# EAGLE schematic bare_bone_arduino (EAGLE 6.4)
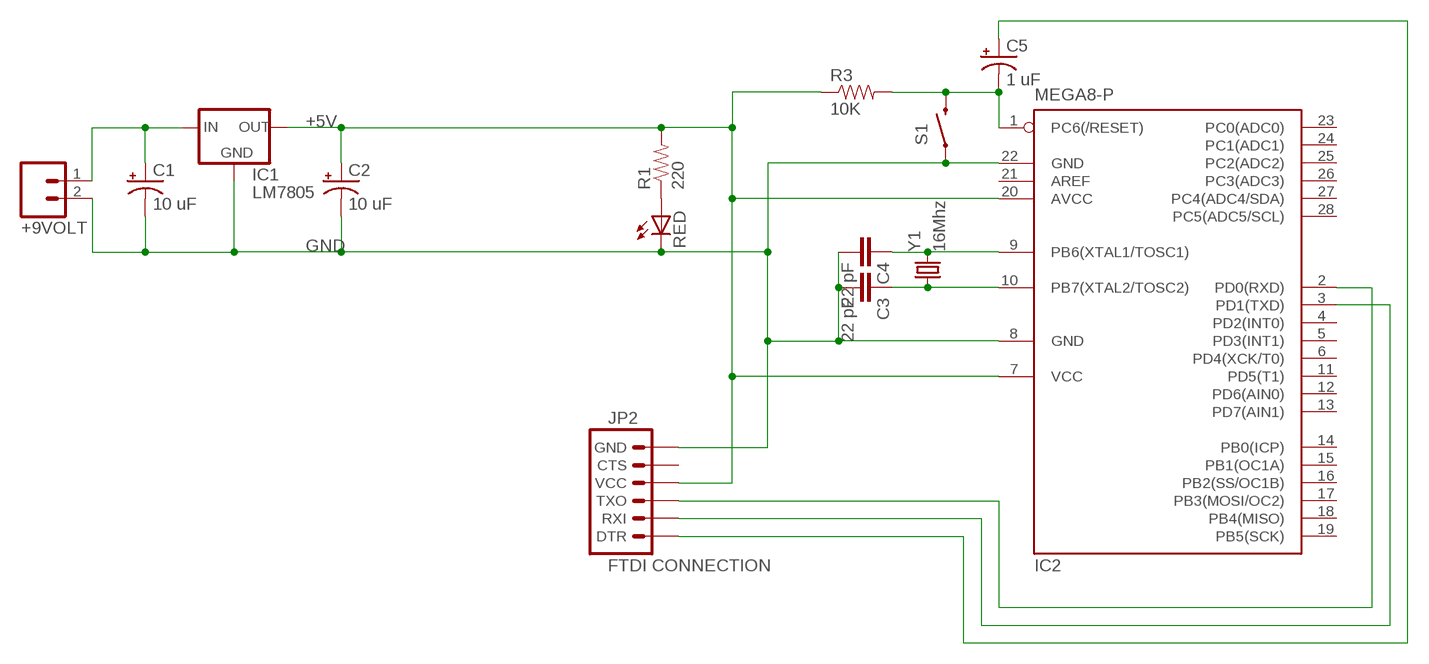
[diagram p0: schematic, sheet 1]

## Parts
+9VOLT  M02PTH4  [1X02_XTRA_BIG]
C1  10 uF  CAP_POLSMD  [VISHAY_C]
C2  10 uF  CAP_POLSMD  [VISHAY_C]
C3  22 pF  CAPPTH1  [CAP-PTH-5MM]
C4  22 pF  CAPPTH1  [CAP-PTH-5MM]
C5  1 uF  CAP_POLPTH1  [CPOL-RADIAL-100UF-25V]
IC1  LM7805  V_REG_78XX-TO-220  [TO-220-ALT]
IC2  MEGA8-P  [DIL28-3]
JP2  FTDI CONNECTION  ARDUINO_SERIAL_PROGRAMPTH  [1X06]
R1  220  RESISTORPTH-1/4W  [AXIAL-0.4]
R3  10K  RESISTORPTH-1/4W  [AXIAL-0.4]
RED  LED3MM  [LED3MM]
S1  SWITCH-MOMENTARY-2PTH  [TACTILE-PTH]
Y1  16Mhz  CRYSTALHC49US  [HC49US]

## Nets
+5V: C2.+ IC1.OUT IC2.7(VCC) IC2.20(AVCC) JP2.4(VCC) R1.P$2 R3.P$1
GND: +9VOLT.2 C1.- C2.- C3.2 C4.2 IC1.GND IC2.8(GND) IC2.22(GND) JP2.6(GND) RED.K(C) S1.1
N$1: +9VOLT.1 C1.+ IC1.IN
N$2: C5.2(-) IC2.1(PC6(/RESET)) R3.P$2 S1.3
N$3: IC2.2(PD0(RXD)) JP2.3(TXO)
N$4: R1.P$1 RED.A
N$5: C4.1 IC2.9(PB6(XTAL1/TOSC1)) Y1.2
N$6: C3.1 IC2.10(PB7(XTAL2/TOSC2)) Y1.1
N$7: IC2.3(PD1(TXD)) JP2.2(RXI)
N$8: C5.1(+) JP2.1(DTR)
Unconnected: IC2.4(PD2(INT0)) IC2.5(PD3(INT1)) IC2.6(PD4(XCK/T0)) IC2.11(PD5(T1)) IC2.12(PD6(AIN0)) IC2.13(PD7(AIN1)) IC2.14(PB0(ICP)) IC2.15(PB1(OC1A)) IC2.16(PB2(SS/OC1B)) IC2.17(PB3(MOSI/OC2)) IC2.18(PB4(MISO)) IC2.19(PB5(SCK)) IC2.21(AREF) IC2.23(PC0(ADC0)) IC2.24(PC1(ADC1)) IC2.25(PC2(ADC2)) IC2.26(PC3(ADC3)) IC2.27(PC4(ADC4/SDA)) IC2.28(PC5(ADC5/SCL)) JP2.5(CTS)

## Library data of the parts
+9VOLT = SparkFun:M02: Header 2 Standard 2-pin 0.1" header. Use with straight break away headers (SKU : PRT-00116), right angle break away headers (PRT-00553), swiss pins (PRT-00743), machine pins (PRT-00117), and female headers (PRT-00115). Molex polarized connector foot print use with SKU : PRT-08233 with associated crimp pins and housings.
C1 C2 C5 = SparkFun:CAP_POL: Capacitor Polarized These are standard SMD and PTH capacitors. Normally 10uF, 47uF, and 100uF in electrolytic and tantalum varieties. Always verify the external diameter of the through hole cap, it varies with capacity, voltage, and manufacturer. The EIA devices should be standard.
C3 C4 = SparkFun:CAP: Capacitor Standard 0603 ceramic capacitor, and 0.1" leaded capacitor.
IC1 = SparkFun:V_REG_78XX: Voltage Regulator Standard 7805 5V regulator. IGO (Input Ground Output). Spark Fun Electronics SKU : COM-00107
IC2 = atmel:MEGA8-P: MICROCONTROLLER 8 Kbytes FLASH, 1 kbytes SRAM, 512 bytes EEPROM, USART, 4-channel 10 bit ADC, 2-channel 8 bit ADC Pin compatible with Atmega48, ATMega88, ATMega168 Source: avr.lbr
JP2 = SparkFun:ARDUINO_SERIAL_PROGRAM
R1 R3 = SparkFun:RESISTOR: Resistor Basic schematic elements and footprints for 0603, 1206, and PTH resistors.
RED = SparkFun:LED: LEDs Standard schematic elements and footprints for 5mm, 3mm, 1206, and 0603 sized LEDs. 5mm - Spark Fun Electronics SKU : COM-00529 (and others)
S1 = SparkFun:SWITCH-MOMENTARY-2
Y1 = SparkFun:CRYSTAL: Crystals Various standard crystals. Proven footprints. Spark Fun Electronics SKU : COM-00534